# Altium schematic sheet StatusLEDs.SchDoc
size A; SheetNumber: 4; SheetTotal: 4
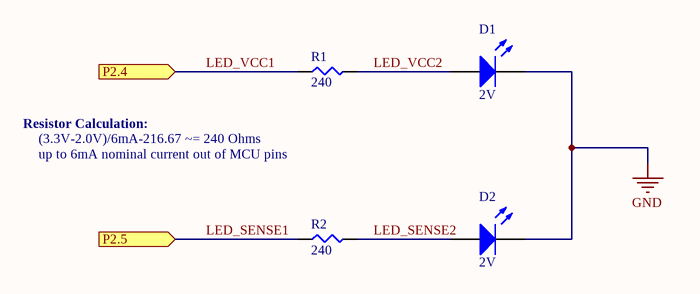
[diagram p0: StatusLEDs.SchDoc]

## Parts
D1  2V  [0805_A]
D2  2V  [0805_A]
R1  240  [SMD-0805-RES]
R2  240  [SMD-0805-RES]

## Ports
P2.4 (in), P2.5 (in)

## Nets
GND: D1.1(K) D2.1(K)
LED_SENSE1: R2.1 ; port P2.5
LED_SENSE2: D2.2(A) R2.2
LED_VCC1: R1.1 ; port P2.4
LED_VCC2: D1.2(A) R1.2

## Notes on the sheet
- Resistor Calculation:
- (3.3V-2.0V)/6mA-216.67 ~= 240 Ohms
- up to 6mA nominal current out of MCU pins

## Library data of the parts
D1 D2 = CMP-1426-00009-1: SMD mono-color Chip LED, WL-SMCW, Bright Green; Manufacturer: Wuerth Elektronik; Manufacturer Part Number: 150080VS75000; Value: 2V
R1 R2 = ERJ-6ENF2400V: RES SMD 240 OHM 1% 1/8W 0805; Manufacturer: Panasonic Electronic Components; Value: 240; Manufacturer Part Number: ERJ-6ENF2400V